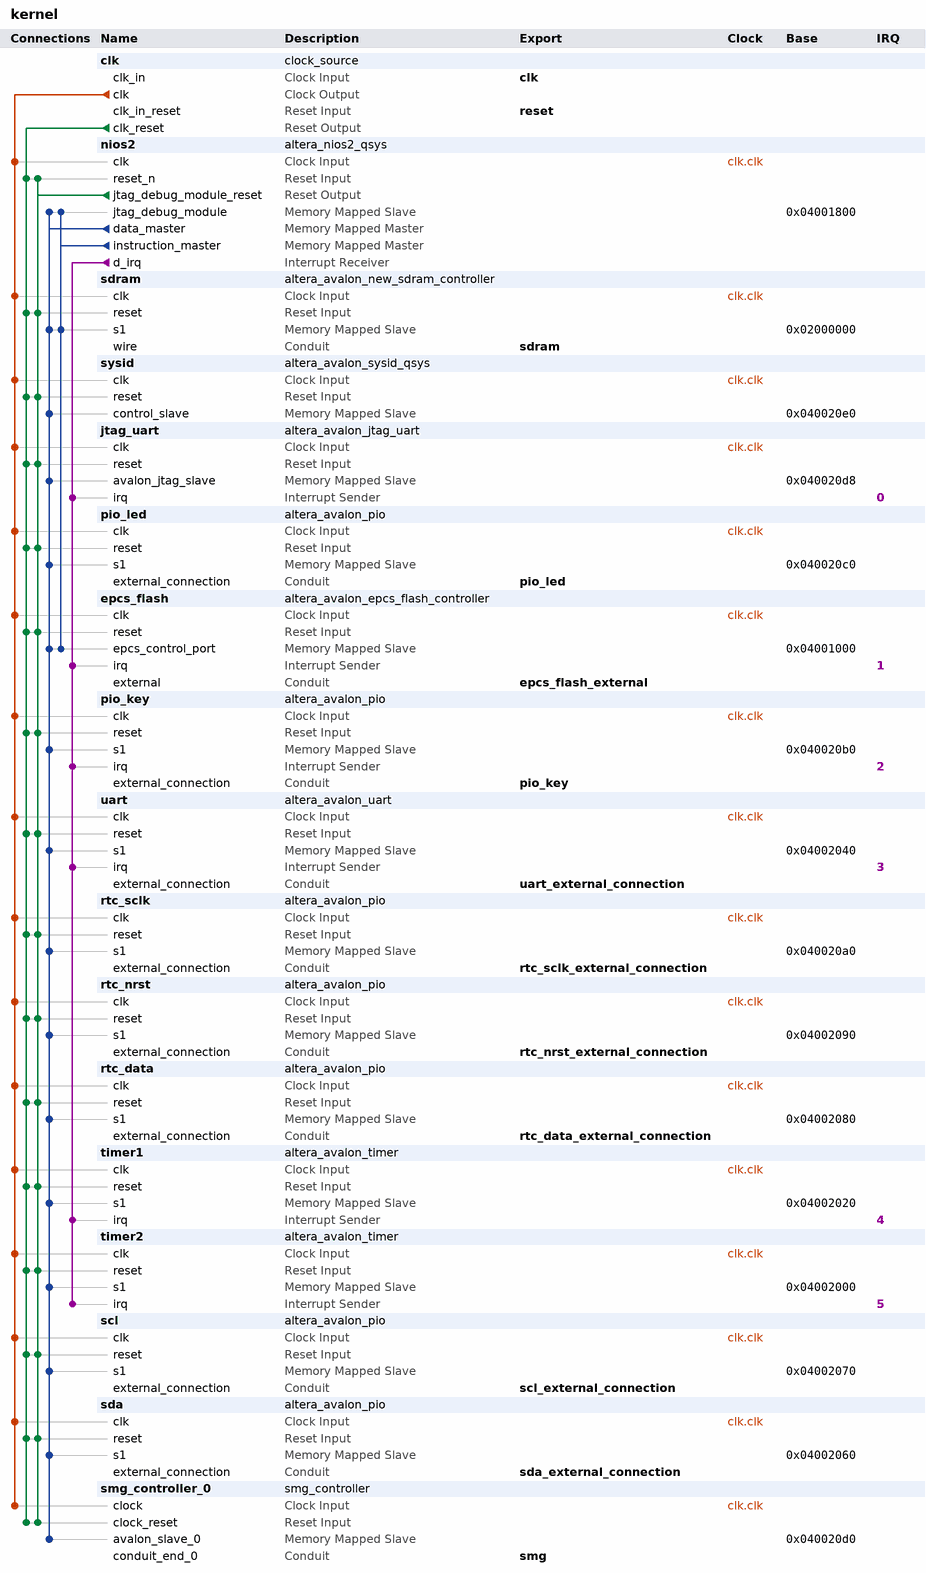
[diagram p0: system contents]
# Platform Designer (Qsys) system kernel, Cyclone IV E EP4CE6F17C8
# Parameters at their usual value, and those the tool derives, are not listed.
package require -exact qsys 12.1
create_system kernel
set_project_property DEVICE_FAMILY {Cyclone IV E}
set_project_property DEVICE EP4CE6F17C8

add_instance clk clock_source 12.1
set_instance_parameter_value clk clockFrequency 100000000

add_instance nios2 altera_nios2_qsys 12.1
set_instance_parameter_value nios2 resetSlave epcs_flash.epcs_control_port
set_instance_parameter_value nios2 exceptionSlave sdram.s1
set_instance_parameter_value nios2 breakSlave nios2.jtag_debug_module
set_instance_parameter_value nios2 impl Fast
set_instance_parameter_value nios2 icache_size 4096

add_instance sdram altera_avalon_new_sdram_controller 12.1
set_instance_parameter_value sdram TAC 5.4
set_instance_parameter_value sdram TRCD 20.0
set_instance_parameter_value sdram TRP 20.0
set_instance_parameter_value sdram TWR 20.0
set_instance_parameter_value sdram casLatency 3
set_instance_parameter_value sdram columnWidth 9
set_instance_parameter_value sdram dataWidth 16
set_instance_parameter_value sdram generateSimulationModel false
set_instance_parameter_value sdram initRefreshCommands 8
set_instance_parameter_value sdram model custom
set_instance_parameter_value sdram numberOfBanks 4
set_instance_parameter_value sdram numberOfChipSelects 1
set_instance_parameter_value sdram powerUpDelay 200.0
set_instance_parameter_value sdram refreshPeriod 7.8125
set_instance_parameter_value sdram rowWidth 13

add_instance sysid altera_avalon_sysid_qsys 12.1
set_instance_parameter_value sysid id 0

add_instance jtag_uart altera_avalon_jtag_uart 12.1
set_instance_parameter_value jtag_uart simInteractiveOptions INTERACTIVE_ASCII_OUTPUT

add_instance pio_led altera_avalon_pio 12.1
set_instance_parameter_value pio_led direction Output
set_instance_parameter_value pio_led width 4

add_instance epcs_flash altera_avalon_epcs_flash_controller 12.1

add_instance pio_key altera_avalon_pio 12.1
set_instance_parameter_value pio_key captureEdge true
set_instance_parameter_value pio_key direction Input
set_instance_parameter_value pio_key edgeType FALLING
set_instance_parameter_value pio_key generateIRQ true
set_instance_parameter_value pio_key irqType EDGE
set_instance_parameter_value pio_key width 1

add_instance uart altera_avalon_uart 12.1
set_instance_parameter_value uart baud 115200
set_instance_parameter_value uart dataBits 8
set_instance_parameter_value uart fixedBaud false
set_instance_parameter_value uart parity NONE
set_instance_parameter_value uart stopBits 1

add_instance rtc_sclk altera_avalon_pio 12.1
set_instance_parameter_value rtc_sclk direction Output
set_instance_parameter_value rtc_sclk width 1

add_instance rtc_nrst altera_avalon_pio 12.1
set_instance_parameter_value rtc_nrst direction Output
set_instance_parameter_value rtc_nrst width 1

add_instance rtc_data altera_avalon_pio 12.1
set_instance_parameter_value rtc_data direction Bidir
set_instance_parameter_value rtc_data width 1

add_instance timer1 altera_avalon_timer 12.1
set_instance_parameter_value timer1 period 500
set_instance_parameter_value timer1 periodUnits MSEC
set_instance_parameter_value timer1 timerPreset FULL_FEATURED

add_instance timer2 altera_avalon_timer 12.1
set_instance_parameter_value timer2 period 500
set_instance_parameter_value timer2 periodUnits MSEC
set_instance_parameter_value timer2 timerPreset FULL_FEATURED

add_instance scl altera_avalon_pio 12.1
set_instance_parameter_value scl direction Output
set_instance_parameter_value scl width 1

add_instance sda altera_avalon_pio 12.1
set_instance_parameter_value sda direction Bidir
set_instance_parameter_value sda width 1

add_instance smg_controller_0 smg_controller 1.0

# connections
add_connection clk.clk epcs_flash.clk clock
add_connection clk.clk jtag_uart.clk clock
add_connection clk.clk nios2.clk clock
add_connection clk.clk pio_key.clk clock
add_connection clk.clk pio_led.clk clock
add_connection clk.clk rtc_data.clk clock
add_connection clk.clk rtc_nrst.clk clock
add_connection clk.clk rtc_sclk.clk clock
add_connection clk.clk scl.clk clock
add_connection clk.clk sda.clk clock
add_connection clk.clk sdram.clk clock
add_connection clk.clk smg_controller_0.clock clock
add_connection clk.clk sysid.clk clock
add_connection clk.clk timer1.clk clock
add_connection clk.clk timer2.clk clock
add_connection clk.clk uart.clk clock
add_connection clk.clk_reset epcs_flash.reset reset
add_connection clk.clk_reset jtag_uart.reset reset
add_connection clk.clk_reset nios2.reset_n reset
add_connection clk.clk_reset pio_key.reset reset
add_connection clk.clk_reset pio_led.reset reset
add_connection clk.clk_reset rtc_data.reset reset
add_connection clk.clk_reset rtc_nrst.reset reset
add_connection clk.clk_reset rtc_sclk.reset reset
add_connection clk.clk_reset scl.reset reset
add_connection clk.clk_reset sda.reset reset
add_connection clk.clk_reset sdram.reset reset
add_connection clk.clk_reset smg_controller_0.clock_reset reset
add_connection clk.clk_reset sysid.reset reset
add_connection clk.clk_reset timer1.reset reset
add_connection clk.clk_reset timer2.reset reset
add_connection clk.clk_reset uart.reset reset
add_connection nios2.jtag_debug_module_reset epcs_flash.reset reset
add_connection nios2.jtag_debug_module_reset jtag_uart.reset reset
add_connection nios2.jtag_debug_module_reset nios2.reset_n reset
add_connection nios2.jtag_debug_module_reset pio_key.reset reset
add_connection nios2.jtag_debug_module_reset pio_led.reset reset
add_connection nios2.jtag_debug_module_reset rtc_data.reset reset
add_connection nios2.jtag_debug_module_reset rtc_nrst.reset reset
add_connection nios2.jtag_debug_module_reset rtc_sclk.reset reset
add_connection nios2.jtag_debug_module_reset scl.reset reset
add_connection nios2.jtag_debug_module_reset sda.reset reset
add_connection nios2.jtag_debug_module_reset sdram.reset reset
add_connection nios2.jtag_debug_module_reset smg_controller_0.clock_reset reset
add_connection nios2.jtag_debug_module_reset sysid.reset reset
add_connection nios2.jtag_debug_module_reset timer1.reset reset
add_connection nios2.jtag_debug_module_reset timer2.reset reset
add_connection nios2.jtag_debug_module_reset uart.reset reset
add_connection nios2.data_master epcs_flash.epcs_control_port avalon
set_connection_parameter_value nios2.data_master/epcs_flash.epcs_control_port baseAddress 0x04001000
add_connection nios2.data_master jtag_uart.avalon_jtag_slave avalon
set_connection_parameter_value nios2.data_master/jtag_uart.avalon_jtag_slave baseAddress 0x040020d8
add_connection nios2.data_master nios2.jtag_debug_module avalon
set_connection_parameter_value nios2.data_master/nios2.jtag_debug_module baseAddress 0x04001800
add_connection nios2.data_master pio_key.s1 avalon
set_connection_parameter_value nios2.data_master/pio_key.s1 baseAddress 0x040020b0
add_connection nios2.data_master pio_led.s1 avalon
set_connection_parameter_value nios2.data_master/pio_led.s1 baseAddress 0x040020c0
add_connection nios2.data_master rtc_data.s1 avalon
set_connection_parameter_value nios2.data_master/rtc_data.s1 baseAddress 0x04002080
add_connection nios2.data_master rtc_nrst.s1 avalon
set_connection_parameter_value nios2.data_master/rtc_nrst.s1 baseAddress 0x04002090
add_connection nios2.data_master rtc_sclk.s1 avalon
set_connection_parameter_value nios2.data_master/rtc_sclk.s1 baseAddress 0x040020a0
add_connection nios2.data_master scl.s1 avalon
set_connection_parameter_value nios2.data_master/scl.s1 baseAddress 0x04002070
add_connection nios2.data_master sda.s1 avalon
set_connection_parameter_value nios2.data_master/sda.s1 baseAddress 0x04002060
add_connection nios2.data_master sdram.s1 avalon
set_connection_parameter_value nios2.data_master/sdram.s1 baseAddress 0x02000000
add_connection nios2.data_master smg_controller_0.avalon_slave_0 avalon
set_connection_parameter_value nios2.data_master/smg_controller_0.avalon_slave_0 baseAddress 0x040020d0
add_connection nios2.data_master sysid.control_slave avalon
set_connection_parameter_value nios2.data_master/sysid.control_slave baseAddress 0x040020e0
add_connection nios2.data_master timer1.s1 avalon
set_connection_parameter_value nios2.data_master/timer1.s1 baseAddress 0x04002020
add_connection nios2.data_master timer2.s1 avalon
set_connection_parameter_value nios2.data_master/timer2.s1 baseAddress 0x04002000
add_connection nios2.data_master uart.s1 avalon
set_connection_parameter_value nios2.data_master/uart.s1 baseAddress 0x04002040
add_connection nios2.instruction_master epcs_flash.epcs_control_port avalon
set_connection_parameter_value nios2.instruction_master/epcs_flash.epcs_control_port baseAddress 0x04001000
add_connection nios2.instruction_master nios2.jtag_debug_module avalon
set_connection_parameter_value nios2.instruction_master/nios2.jtag_debug_module baseAddress 0x04001800
add_connection nios2.instruction_master sdram.s1 avalon
set_connection_parameter_value nios2.instruction_master/sdram.s1 baseAddress 0x02000000
add_connection nios2.d_irq epcs_flash.irq interrupt
set_connection_parameter_value nios2.d_irq/epcs_flash.irq irqNumber 1
add_connection nios2.d_irq jtag_uart.irq interrupt
set_connection_parameter_value nios2.d_irq/jtag_uart.irq irqNumber 0
add_connection nios2.d_irq pio_key.irq interrupt
set_connection_parameter_value nios2.d_irq/pio_key.irq irqNumber 2
add_connection nios2.d_irq timer1.irq interrupt
set_connection_parameter_value nios2.d_irq/timer1.irq irqNumber 4
add_connection nios2.d_irq timer2.irq interrupt
set_connection_parameter_value nios2.d_irq/timer2.irq irqNumber 5
add_connection nios2.d_irq uart.irq interrupt
set_connection_parameter_value nios2.d_irq/uart.irq irqNumber 3

# exported interfaces
add_interface clk clock sink
set_interface_property clk EXPORT_OF clk.clk_in
add_interface reset reset sink
set_interface_property reset EXPORT_OF clk.clk_in_reset
add_interface sdram conduit end
set_interface_property sdram EXPORT_OF sdram.wire
add_interface pio_led conduit end
set_interface_property pio_led EXPORT_OF pio_led.external_connection
add_interface epcs_flash_external conduit end
set_interface_property epcs_flash_external EXPORT_OF epcs_flash.external
add_interface pio_key conduit end
set_interface_property pio_key EXPORT_OF pio_key.external_connection
add_interface uart_external_connection conduit end
set_interface_property uart_external_connection EXPORT_OF uart.external_connection
add_interface rtc_sclk_external_connection conduit end
set_interface_property rtc_sclk_external_connection EXPORT_OF rtc_sclk.external_connection
add_interface rtc_nrst_external_connection conduit end
set_interface_property rtc_nrst_external_connection EXPORT_OF rtc_nrst.external_connection
add_interface rtc_data_external_connection conduit end
set_interface_property rtc_data_external_connection EXPORT_OF rtc_data.external_connection
add_interface scl_external_connection conduit end
set_interface_property scl_external_connection EXPORT_OF scl.external_connection
add_interface sda_external_connection conduit end
set_interface_property sda_external_connection EXPORT_OF sda.external_connection
add_interface smg conduit end
set_interface_property smg EXPORT_OF smg_controller_0.conduit_end_0

save_system kernel.qsys
